# Altium schematic sheet SensorBoard.SchDoc
size A3; SheetNumber: 5; SheetTotal: 5
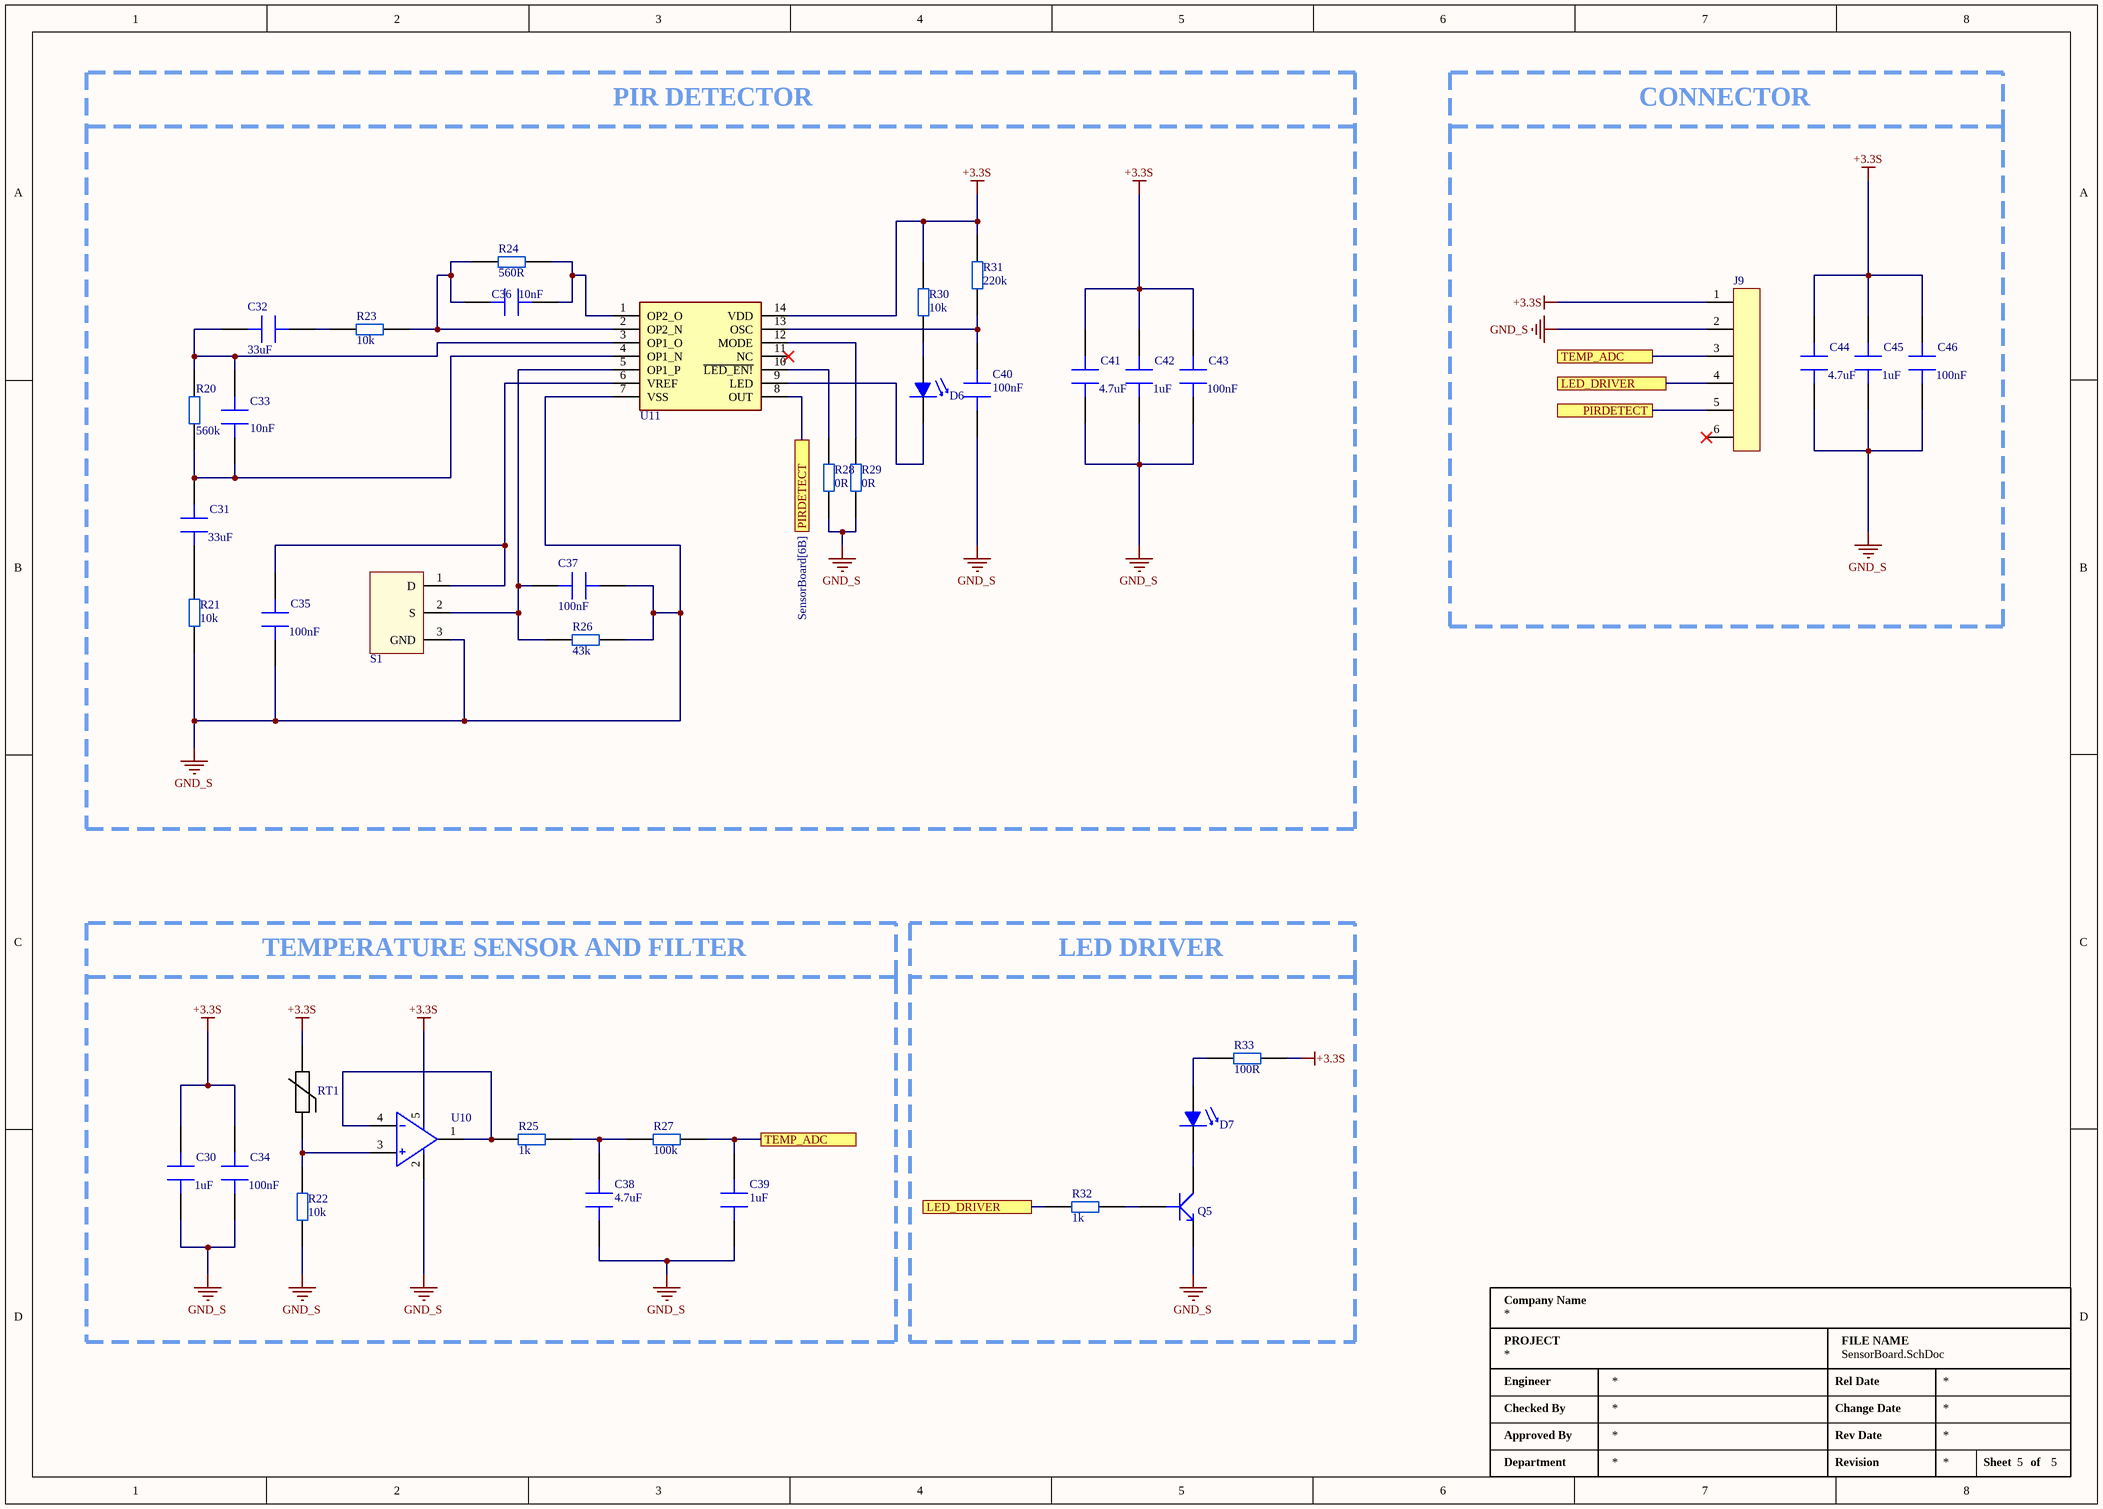
[diagram p0: SensorBoard.SchDoc]

## Parts
C30  value 1uF  [CAP 0805]  (hidden comment: Auto Grade Capacitor,0805,X7R,10)
C31  value 33uF  [CAP 1206]  (hidden comment: CAP CER 33UF 25V X5R 1206)
C32  value 33uF  [CAP 1206]  (hidden comment: CAP CER 33UF 25V X5R 1206)
C33  value 10nF  [CAP 0603]  (hidden comment: CAP CER 10nF 0603)
C34  value 100nF  [CAP 0805]  (hidden comment: CAP CER 0.1UF 50V X7R 0805)
C35  value 100nF  [CAP 0603]  (hidden comment: CAP CER 100nF 0603)
C36  value 10nF  [CAP 0603]  (hidden comment: CAP CER 10nF 0603)
C37  value 100nF  [CAP 0603]  (hidden comment: CAP CER 100nF 0603)
C38  value 4.7uF  [CAP 0805]  (hidden comment: CAP CER 4.7UF 25V X5R 0805)
C39  value 1uF  [CAP 0805]  (hidden comment: Auto Grade Capacitor,0805,X7R,10)
C40  value 100nF  [CAP 0603]  (hidden comment: CAP CER 100nF 0603)
C41  value 4.7uF  [CAP 0805]  (hidden comment: CAP CER 4.7UF 25V X5R 0805)
C42  value 1uF  [CAP 0805]  (hidden comment: Auto Grade Capacitor,0805,X7R,10)
C43  value 100nF  [CAP 0805]  (hidden comment: CAP CER 0.1UF 50V X7R 0805)
C44  value 4.7uF  [CAP 0805]  (hidden comment: CAP CER 4.7UF 25V X5R 0805)
C45  value 1uF  [CAP 0805]  (hidden comment: Auto Grade Capacitor,0805,X7R,10)
C46  value 100nF  [CAP 0805]  (hidden comment: CAP CER 0.1UF 50V X7R 0805)
D6  LED GREEN CLEAR 0805 SMD  [LED 0805]  (value not drawn)
D7  LED RED CLEAR 0805 SMD  [LED 0805]  (value not drawn)
J9  CONN HEADER VERT 6POS 1.5MM  [TUNIK 6P 2.5mm]  (value not drawn)
Q5  TRANS NPN 40V 0.2A SOT23  [SOT-23-3]  (value not drawn)
R20  value 560k  [RES 0603]  (hidden comment: RES 560K OHM 5% 1/10W 0603)
R21  value 10k  [RES 0603]  (hidden comment: RES 10K 0603)
R22  value 10k  [RES 0603]  (hidden comment: RES 10K 0603)
R23  value 10k  [RES 0603]  (hidden comment: RES 10K 0603)
R24  value 560R  [RES 0603]  (hidden comment: RES 560 OHM 1% 1/10W 0603)
R25  value 1k  [RES 0603]  (hidden comment: RES 10K 0603)
R26  value 43k  [RES 0603]  (hidden comment: RES 43K OHM 1% 1/10W 0603)
R27  value 100k  [RES 0603]  (hidden comment: RES 10K 0603)
R28  value 0R  [RES 0603]  (hidden comment: RC0603JR-070RL)
R29  value 0R  [RES 0603]  (hidden comment: RC0603JR-070RL)
R30  value 10k  [RES 0603]  (hidden comment: RES 10K 0603)
R31  value 220k  [RES 0603]  (hidden comment: RES 220K OHM 1% 1/10W 0603)
R32  value 1k  [RES 0603]  (hidden comment: RES 10K 0603)
R33  value 100R  [RES 0603]  (hidden comment: RES 10K 0603)
RT1  SENSOR PTC 10KOHM 1% 1206  [RES1206]  (value not drawn)
S1  LHI 878/3902  [LHI 878]  (value not drawn)
U10  IC OPAMP GP 1 CIRCUIT SOT23-5  [SOT-23-5]  (value not drawn)
U11  IC PIR DETECTOR CTLR 14SOIC  [SOIC14]  (value not drawn)

## Blocks framed on the sheet
PIR DETECTOR: C31-C33 C35-C37 C40-C43 D6 R20 R21 R23 R24 R26 R28-R31 S1 U11
CONNECTOR: C44-C46 J9
TEMPERATURE SENSOR AND FILTER: C30 C34 C38 C39 R22 R25 R27 RT1 U10
LED DRIVER: D7 Q5 R32 R33

## Ports
LED_DRIVER (see Microcontroller[7B], Power Management[6C], SensorBoard[4D]), LED_DRIVER (see Microcontroller[7B], Power Management[6C], SensorBoard[6B]), PIRDETECT (see SensorBoard[4B]), PIRDETECT (see SensorBoard[6B]), TEMP_ADC (see Microcontroller[7A], Power Management[6C], SensorBoard[3D]), TEMP_ADC (see Microcontroller[7A], Power Management[6C], SensorBoard[6A])

## Nets
+3.3S: C30.2 C34.2 C41.2 C42.2 C43.2 C44.2 C45.2 C46.2 J9.1 R30.2 R31.2 R33.2 RT1.2 U10.5(V+) U11.14(VDD)
GND_S: C30.1 C34.1 C35.1 C37.1 C38.1 C39.1 C40.2 C41.1 C42.1 C43.1 C44.1 C45.1 C46.1 J9.2 Q5.2(E) R21.1 R22.1 R26.1 R28.1 R29.1 S1.3(GND) U11.7(VSS)
LED_DRIVER: J9.4 R32.1 ; port LED_DRIVER
PIRDETECT: J9.5 U11.8(OUT) ; port PIRDETECT
TEMP_ADC: C39.2 J9.3 R27.1 ; port TEMP_ADC
NetC31_1: C31.1 R21.2
NetC31_2: C31.2 C33.1 R20.1 U11.4(OP1_N)
NetC32_1: C32.1 C33.2 R20.2 U11.3(OP1_O)
NetC32_2: C32.2 R23.1
NetC35_2: C35.2 S1.1(D) U11.6(VREF)
NetC36_1: C36.1 R23.2 R24.1 U11.2(OP2_N)
NetC36_2: C36.2 R24.2 U11.1(OP2_O)
NetC37_2: C37.2 R26.2 S1.2(S) U11.5(OP1_P)
NetC38_2: C38.2 R25.1 R27.2
NetC40_1: C40.1 R31.1 U11.13(OSC)
NetD6_A: D6.A R30.1
NetD6_C: D6.C U11.9(LED)
NetD7_A: D7.A R33.1
NetD7_C: D7.C Q5.3(C)
NetQ5_1: Q5.1(B) R32.2
NetR22_2: R22.2 RT1.1 U10.3(+IN)
NetR25_2: R25.2 U10.1(OUT) U10.4(-IN)
NetR28_2: R28.2 U11.10(~{LED_EN!})
NetR29_2: R29.2 U11.12(MODE)

Not connected (* = marked no-connect by the designer): J9 6*; U10 2(V-); U11 11(NC)*

## Notes on the sheet
- Company Name
- Engineer
- PROJECT
- Rel Date
- FILE NAME
- Checked By
- Approved By
- Rev Date
- Change Date
- Department
- Revision
- Sheet
- of

## Library data of the parts
C30 C39 C42 C45 = CAP MLCC 1uF 0805 MLCC: Multilayer Ceramic Capacitor, 1 uF, 25 V, ï¿½ 10%, X7R, 0805 [2012 Metric]; Manufacturer: KEMET; Manufacturer Part Number: C0805C105K3RACTU; Material: 4241ConductorMaterial; Voltage Rating: 25V; Supplier: Digikey; Supplier Part Number: 399-C0805C105K3RAC7800CT-ND; RoHS: Yes; Category: Ceramic Capacitors; Stock: 115775; Pricing: 1=0,13, 10=0,091, 50=0,054, 100=0,0425, 500=0,03142, 1000=0,02601 (USD); Mounting Technology: Surface Mount; Case/Package: 0805; Pins: 2; Case Code (Imperial): 0805; Case Code (Metric): 2012; Dielectric Material: Ceramic; Min Operating Temperature: -55°C; Max Operating Temperature: 125°C; Tolerance: 10%; Packaging: Tape and Reel; Termination: SMD/SMT; Series: C; Dielectric: X7R; Package Quantity: 2500; Voltage Rating (DC): 25V; Construction: Flat; Voltage: 25V; Length: 2mm; Width: 0.049inch; Height: 1.25mm; Depth: 1.25mm; Thickness: 0.055inch; Radiation Hardening: No; RoHS Compliant: Yes; Reach SVHC Compliant: No
C31 C32 = CAP MLCC 33uF 1206: Multilayer Ceramic Capacitor, 33 uF, 25 V, ± 20%, X5R, 1206 [3216 Metric]; Manufacturer: TDK; Manufacturer Part Number: C3216X5R1E336M160AC; Material: 4241ConductorMaterial; Designed By: SEFA; Supplier: Digikey; Supplier Part Number: 445-8046-1-ND; RoHS: Yes; Category: Ceramic Capacitors; Stock: 201261; Pricing: 1=0,98, 10=0,734, 50=0,6696, 100=0,5485, 500=0,43776, 1000=0,38625 (USD); ComponentLink1URL: https://datasheet.ciiva.com/24216/c3216x5r1e336m160ac-265051-24216512.pdf?src-supplier=Mouser; ComponentLink1Description: https://datasheet.ciiva.com/24216/c3216x5r1e336m160ac-265051-24216512.pdf?src-supplier=Mouser; ComponentLink2URL: https://datasheet.ciiva.com/6285/tdkmlcccaprange-6285278.pdf?src-supplier=Digikey; ComponentLink2Description: https://datasheet.ciiva.com/6285/tdkmlcccaprange-6285278.pdf?src-supplier=Digikey
C33 C36 = CAP MLCC 10nF 0603: Multilayer Ceramic Capacitor, 0.01 uF, 50 V, ± 10%, X7R, 0603 [1608 Metric]; Manufacturer: Yageo; Manufacturer Part Number: CC0603KRX7R9BB103; Voltage Rating: 50V; Insulation Resistance: 100GR; Designed By: SEFA; Supplier: Digikey; Supplier Part Number: 311-1085-1-ND; RoHS: Yes; Category: Ceramic Capacitors; Stock: 4173563; Pricing: 1=0,1, 10=0,031, 50=0,0176, 100=0,0136, 500=0,01026, 1000=0,00805 (USD); Mounting Technology: Surface Mount; Case/Package: 0603; Pins: 2; Case Code (Metric): 1608; Case Code (Imperial): 0603; Material: Ceramic; Min Operating Temperature: -55°C; Max Operating Temperature: 125°C; Tolerance: 10%; Packaging: Tape and Reel; Voltage Rating (DC): 50V; Package Quantity: 1; Dielectric: X7R; Termination: SMD/SMT; Voltage: 50V; Series: CC; Length: 1.6mm; Width: 0.031inch; Height: 0.8mm; Thickness: 0.035inch; Depth: 0.8mm; Radiation Hardening: No; RoHS Compliant: Yes; Reach SVHC Compliant: Unknown; Lead Free: 5697LeadFree; Halogen Free: 5694HalogenFree
C34 C43 C46 = CAP MLCC 100nF 0805: Multilayer Ceramic Capacitor, 0.1 uF, 50 V, ± 10%, X7R, 0805 [2012 Metric]; Manufacturer: Yageo; Manufacturer Part Number: CC0805KRX7R9BB104; Insulation Resistance: 100GR; Desined By: SEFA; Supplier: Digikey; Supplier Part Number: 311-1140-1-ND; RoHS: Yes; Category: Ceramic Capacitors; Stock: 4906465; Pricing: 1=0,1, 10=0,07, 50=0,0418, 100=0,0329, 500=0,02428, 1000=0,0201, 4000=0,01711, 8000=0,01592, 12000=0,01512, 28000=0,01433, 100000=0,01085, 200000=0,01059, 400000=0,00995 (USD); Mounting Technology: Surface Mount; Case/Package: 0805; Pins: 2; Case Code (Metric): 2012; Case Code (Imperial): 0805; Material: Ceramic; Min Operating Temperature: -55°C; Max Operating Temperature: 125°C; Tolerance: 10%; Dielectric: X7R; Voltage: 50V; Packaging: Tape and Reel; Voltage Rating: 50V; Package Quantity: 4000; Termination: SMD/SMT; Series: CC; Length: 2mm; Height: 0.85mm; Depth: 1.25mm; Radiation Hardening: No; RoHS Compliant: Yes; Reach SVHC Compliant: No; Lead Free: 5697LeadFree; Halogen Free: 5694HalogenFree; ComponentLink1URL: https://datasheet.ciiva.com/11786/0900766b80d84f1d-11786009.pdf?src-supplier=Rs; ComponentLink1Description: https://datasheet.ciiva.com/11786/0900766b80d84f1d-11786009.pdf?src-supplier=Rs; ComponentLink2URL: https://datasheet.ciiva.com/46393/1734573-46393307.pdf?src-supplier=Element14; ComponentLink2Description: https://datasheet.ciiva.com/46393/1734573-46393307.pdf?src-supplier=Element14; ComponentLink3URL: https://datasheet.ciiva.com/155/mlccorderingcode-155930.pdf?src-supplier=Digikey; ComponentLink3Description: https://datasheet.ciiva.com/155/mlccorderingcode-155930.pdf?src-supplier=Digikey; ComponentLink4URL: https://datasheet.ciiva.com/28450/1489800-28450805.pdf?src-supplier=Element14; ComponentLink4Description: https://datasheet.ciiva.com/28450/1489800-28450805.pdf?src-supplier=Element14; ComponentLink5URL: https://datasheet.ciiva.com/155/mlccorderingcode-155929.pdf?src-supplier=Digikey; ComponentLink5Description: https://datasheet.ciiva.com/155/mlccorderingcode-155929.pdf?src-supplier=Digikey; ComponentLink6URL: https://datasheet.ciiva.com/155/mlccorderingcode-155931.pdf?src-supplier=Digikey; ComponentLink6Description: https://datasheet.ciiva.com/155/mlccorderingcode-155931.pdf?src-supplier=Digikey; ComponentLink7URL: https://datasheet.ciiva.com/11464/upy-gphc-x7r-6-3v-to-50v-8-11464757.pdf?src-supplier=Avnet; ComponentLink7Description: https://datasheet.ciiva.com/11464/upy-gphc-x7r-6-3v-to-50v-8-11464757.pdf?src-supplier=Avnet; ComponentLink8URL: https://datasheet.ciiva.com/29242/445210-da-01-en-kerko-chip-0805-x7r-0-1uf-10proz-50vg-29242074.pdf?src-supplier=Conrad; ComponentLink8Description: https://datasheet.ciiva.com/29242/445210-da-01-en-kerko-chip-0805-x7r-0-1uf-10proz-50vg-29242074.pdf?src-supplier=Conrad
C35 C37 C40 = CAP MLCC 100nF 0603: Multilayer Ceramic Capacitor, 0.1 uF, 50 V, ± 10%, X7R, 0603 [1608 Metric]; Manufacturer: Kyocera AVX; Manufacturer Part Number: 06035C104K4T2A; Material: 4241ConductorMaterial; Voltage Rating: 50V; Dissipation Factor: 2.5%; Designed By: SEFA; Supplier: Mouser; Supplier Part Number: 581-06035C104K4; RoHS: Yes; Category: Ceramic Capacitors; Stock: 306954; Pricing: 1=0,1, 10=0,043, 50=0,043, 100=0,021, 1000=0,013, 10000=0,01 (USD); Mounting Technology: Surface Mount; Case/Package: 0603; Pins: 2; Case Code (Metric): 1608; Case Code (Imperial): 0603; Dielectric Material: 4241ConductorMaterial; Min Operating Temperature: -55°C; Max Operating Temperature: 125°C; Package Quantity: 1; Tolerance: 10%; Packaging: Tape and Reel; Voltage Rating (DC): 50V; Dielectric: X7R; Termination: SMD/SMT; Voltage: 50V; Series: -; Construction: Flat; Length: 1.6mm; Width: 0.032inch; Height: 0.9mm; Thickness: 0.035inch; Depth: 0.81mm; Ratings: AEC-Q200; Radiation Hardening: No; Lead Free: 5697LeadFree; Reach SVHC Compliant: No; RoHS Compliant: Yes; ComponentLink1URL: https://datasheet.ciiva.com/26859/getdatasheetpartid-379206-26859871.pdf?src-supplier=Verical; ComponentLink1Description: https://datasheet.ciiva.com/26859/getdatasheetpartid-379206-26859871.pdf?src-supplier=Verical; ComponentLink2URL: https://datasheet.ciiva.com/11786/0900766b80dc2409-11786365.pdf?src-supplier=Rs; ComponentLink2Description: https://datasheet.ciiva.com/11786/0900766b80dc2409-11786365.pdf?src-supplier=Rs; ComponentLink3URL: https://datasheet.ciiva.com/11503/cauto-11503989.pdf?src-supplier=Avnet; ComponentLink3Description: https://datasheet.ciiva.com/11503/cauto-11503989.pdf?src-supplier=Avnet; ComponentLink4URL: https://datasheet.ciiva.com/1457/1679506-1457867.pdf?src-supplier=Element14; ComponentLink4Description: https://datasheet.ciiva.com/1457/1679506-1457867.pdf?src-supplier=Element14; ComponentLink5URL: https://datasheet.ciiva.com/1124/1679506-1124898.pdf?src-supplier=Element14; ComponentLink5Description: https://datasheet.ciiva.com/1124/1679506-1124898.pdf?src-supplier=Element14; ComponentLink6URL: https://datasheet.ciiva.com/28613/1679506-28613279.pdf?src-supplier=Element14; ComponentLink6Description: https://datasheet.ciiva.com/28613/1679506-28613279.pdf?src-supplier=Element14; ComponentLink7URL: https://datasheet.ciiva.com/152/cauto-152703.pdf?src-supplier=Digikey; ComponentLink7Description: https://datasheet.ciiva.com/152/cauto-152703.pdf?src-supplier=Digikey; ComponentLink8URL: https://datasheet.ciiva.com/152/cauto-152702.pdf?src-supplier=Digikey; ComponentLink8Description: https://datasheet.ciiva.com/152/cauto-152702.pdf?src-supplier=Digikey; ComponentLink9URL: https://datasheet.ciiva.com/152/cauto-152704.pdf?src-supplier=Digikey; ComponentLink9Description: https://datasheet.ciiva.com/152/cauto-152704.pdf?src-supplier=Digikey; ComponentLink10URL: https://datasheet.ciiva.com/5427/cauto-360-5427029.pdf?src-supplier=Mouser; ComponentLink10Description: https://datasheet.ciiva.com/5427/cauto-360-5427029.pdf?src-supplier=Mouser
C38 C41 C44 = CAP MLCC 4.7uF 0805 MLCC: Multilayer Ceramic Capacitor, 4.7 uF, 25 V, ± 10%, X5R, 0805 [2012 Metric]; Manufacturer: Samsung; Manufacturer Part Number: CL21A475KAQNNNE; Designed By: SEFA; Supplier: Digikey; Supplier Part Number: 1276-1244-2-ND; RoHS: Yes; Category: Ceramic Capacitors; Stock: 3176000; Pricing: 2000=0,01305, 4000=0,01194, 10000=0,0111, 14000=0,01055, 50000=0,00978 (USD); Mounting Technology: Surface Mount; Case/Package: 0805; Case Code (Metric): 2012; Case Code (Imperial): 0805; Material: Ceramic; Min Operating Temperature: -55°C; Max Operating Temperature: 85°C; Packaging: Tape and Reel; Tolerance: 10%; Voltage Rating: 25V; Dielectric: X5R; Voltage Rating (DC): 25V; Series: CL; Construction: Flat; Length: 2mm; Height: 1.25mm; Depth: 1.25mm; Radiation Hardening: No; Lead Free: Lead Free; RoHS Compliant: Yes; ComponentLink1URL: https://datasheet.ciiva.com/25798/cl21a475kaqnnne-25798882.pdf?src-supplier=Digikey; ComponentLink1Description: https://datasheet.ciiva.com/25798/cl21a475kaqnnne-25798882.pdf?src-supplier=Digikey
D6 = LED GREEN 0805: WURTH ELEKTRONIK - 150080GS75000 - LED, Green, SMD, 0805, 30 mA, 3.2 V, 520 nm; Manufacturer: Wurth Electronics; Lens Color: Colorless; Viewing Angle: 140°; Lens Style: Clear,Flat,Rectangular; Luminous Intensity: 450mcd; Forward Voltage: 3.2V; Wavelength: 520nm; Forward Current: 30mA; Test Current: 20mA; Max Reverse Voltage (DC): 5V; Power Dissipation: 105mW; Lens Size: 1.25mm; Designed By: SEFA; Supplier: Digikey; Supplier Part Number: 732-4983-1-ND; Manufacturer Part Number: 150080GS75000; RoHS: Yes; Category: LEDs; Stock: 59501; Pricing: 1=0,18, 50=0,176, 100=0,151, 500=0,131 (USD); Mounting Technology: Surface Mount; Case/Package: 0805; Color: Green; Case Code (Metric): 2012; Case Code (Imperial): 0805; Min Operating Temperature: -40°C; Max Operating Temperature: 85°C; Package Quantity: 1; Packaging: Cut Tape; Dominant Wavelength: 520nm; Series: WL-SMCW; Lens Transparency: Clear; Reverse Voltage: 5V; Length: 2mm; Width: 1.25mm; Height: 0.8mm; RoHS Compliant: Yes; Reach SVHC Compliant: Unknown; ComponentLink1URL: https://datasheet.ciiva.com/29563/150080gs75000-29563008.pdf?src-supplier=Digikey; ComponentLink1Description: https://datasheet.ciiva.com/29563/150080gs75000-29563008.pdf?src-supplier=Digikey; ComponentLink2URL: https://datasheet.ciiva.com/29279/759434-da-01-en-chipled-0805-w-kl-gruen-150080gs75000-29279039.pdf?src-supplier=Conrad; ComponentLink2Description: https://datasheet.ciiva.com/29279/759434-da-01-en-chipled-0805-w-kl-gruen-150080gs75000-29279039.pdf?src-supplier=Conrad
D7 = LED RED 0805: LED Uni-Color Red 630nm 2-Pin Chip 0805(2012Metric) T/R; Manufacturer: Wurth Electronics; Manufacturer Part Number: 150080RS75000; Lens Color: Colorless; Luminous Intensity: 150mcd; Viewing Angle: 140°; Forward Voltage: 2V; Wavelength: 625nm; Lens Style: Clear,Flat,Rectangular; Forward Current: 30mA; Test Current: 20mA; Max Reverse Voltage (DC): 5V; Power Dissipation: 72mW; Lens Size: 1.25mm; Designed By: SEFA; Supplier: Digikey; Supplier Part Number: 732-4984-6-ND; RoHS: Yes; Category: LEDs; Stock: 58430; Pricing: 1=0,18, 50=0,176, 100=0,151, 500=0,131 (USD); Mounting Technology: Surface Mount; Case/Package: 0805; Color: Red; Case Code (Metric): 2012; Case Code (Imperial): 0805; Min Operating Temperature: -40°C; Max Operating Temperature: 85°C; Package Quantity: 1; Packaging: Cut Tape; Dominant Wavelength: 625nm; Series: WL-SMCW; Lens Transparency: Clear; Length: 2mm; Width: 1.25mm; Height: 0.8mm; RoHS Compliant: Yes; Reach SVHC Compliant: Unknown; ComponentLink1URL: https://datasheet.ciiva.com/22656/150080rs75000-22656961.pdf?src-supplier=Element14; ComponentLink1Description: https://datasheet.ciiva.com/22656/150080rs75000-22656961.pdf?src-supplier=Element14; ComponentLink2URL: https://datasheet.ciiva.com/29279/759435-da-01-en-chipled-0805-w-kl-rot-150080rs75000-29279032.pdf?src-supplier=Conrad; ComponentLink2Description: https://datasheet.ciiva.com/29279/759435-da-01-en-chipled-0805-w-kl-rot-150080rs75000-29279032.pdf?src-supplier=Conrad
J9 = TUNIK 6P 2.5mm: Header B6B-ZR, 1.50mm, 6-contacts, top entry, THT, /2000/box; Manufacturer: JST; Gender: 29Gender; Number of Contacts: 6NUMBER; Designed By: SEFA; Supplier: Digikey; Supplier Part Number: 455-B6B-ZR-ND; Manufacturer Part Number: B6B-ZR; RoHS: Yes; Category: Board to Board Connectors; Stock: 104604; Pricing: 1=0,3, 10=0,256, 100=0,1994, 2000=0,13512, 6000=0,1221, 10000=0,11396 (USD); Housing Color: 50Colour; Orientation: 5495OrientationType; Lead Free: 5698LeadFree; ComponentLink1URL: https://datasheet.ciiva.com/6905/zhconnector-6905949.pdf?src-supplier=Digikey; ComponentLink1Description: https://datasheet.ciiva.com/6905/zhconnector-6905949.pdf?src-supplier=Digikey
Q5 = MMBT3904 NPN TR: Transistor: NPN; bipolar; 40V; 0.2A; 350mW; -55+150 deg.C; SMD; SOT23; Manufacturer: Diotec; Designed By: SEFA; Supplier: Mouser; Supplier Part Number: 637-MMBT3904; Manufacturer Part Number: MMBT3904; RoHS: Yes; Category: BJTs; Stock: 65126; Pricing: 1=0,1, 10=0,057, 50=0,057, 100=0,047, 1000=0,033, 10000=0,016 (USD); ComponentLink1URL: http://datasheet.octopart.com/MMBT3904-Diotec-datasheet-20771870.pdf?src-supplier=Verical; ComponentLink1Description: http://datasheet.octopart.com/MMBT3904-Diotec-datasheet-20771870.pdf?src-supplier=Verical; ComponentLink2URL: http://datasheet.octopart.com/MMBT3904-Diotec-datasheet-20771870.pdf?src-supplier=Mouser; ComponentLink2Description: http://datasheet.octopart.com/MMBT3904-Diotec-datasheet-20771870.pdf?src-supplier=Mouser; ComponentLink3URL: http://datasheet.octopart.com/MMBT3904-Diotec-datasheet-20771870.pdf?src-supplier=Onlinecomponents.com; ComponentLink3Description: http://datasheet.octopart.com/MMBT3904-Diotec-datasheet-20771870.pdf?src-supplier=Onlinecomponents.com; ComponentLink4URL: http://datasheet.octopart.com/MMBT3904-Diotec-datasheet-20771870.pdf?src-supplier=Distrelec; ComponentLink4Description: http://datasheet.octopart.com/MMBT3904-Diotec-datasheet-20771870.pdf?src-supplier=Distrelec; ComponentLink5URL: http://datasheet.octopart.com/MMBT3904-Diotec-datasheet-20771870.pdf?src-supplier=DComponents; ComponentLink5Description: http://datasheet.octopart.com/MMBT3904-Diotec-datasheet-20771870.pdf?src-supplier=DComponents; ComponentLink6URL: https://datasheet.octopart.com/MMBT3904-Diotec-datasheet-137255044.pdf?src-supplier=TME; ComponentLink6Description: https://datasheet.octopart.com/MMBT3904-Diotec-datasheet-137255044.pdf?src-supplier=TME; ComponentLink7URL: http://datasheet.octopart.com/MMBT3904-Diotec-datasheet-20771870.pdf?src-supplier=Rutronik; ComponentLink7Description: http://datasheet.octopart.com/MMBT3904-Diotec-datasheet-20771870.pdf?src-supplier=Rutronik; ComponentLink8URL: http://datasheet.octopart.com/MMBT3904-Diotec-datasheet-20771870.pdf?src-supplier=Electro+Sonic; ComponentLink8Description: http://datasheet.octopart.com/MMBT3904-Diotec-datasheet-20771870.pdf?src-supplier=Electro+Sonic; ComponentLink9URL: https://datasheet.octopart.com/MMBT3904-Diotec-datasheet-168810005.pdf?src-supplier=SOS+electronic; ComponentLink9Description: https://datasheet.octopart.com/MMBT3904-Diotec-datasheet-168810005.pdf?src-supplier=SOS+electronic
R20 = RES 560k OHM 0603: SMD Chip Resistor, 560 kOhm, ± 5%, 100 mW, 0603 [1608 Metric], Thick Film, General Purpose; Manufacturer: Yageo; Manufacturer Part Number: RC0603JR-07560KL; Power Rating: 100mW; Voltage Rating: 75V; Voltage Rating (DC): 50V; Temperature Coefficient: 100ppm/°C; Designed By: SEFA; Supplier: Digikey; Supplier Part Number: 311-560KGRCT-ND; RoHS: Yes; Category: Chip SMD Resistors; Stock: 404528; Pricing: 1=0,1, 10=0,015, 50=0,0092, 100=0,0076, 500=0,00512, 1000=0,00437 (USD); Case/Package: 0603; Pins: 2; Case Code (Metric): 1608; Case Code (Imperial): 0603; Weight: 7.1E-05oz; Min Operating Temperature: -55°C; Max Operating Temperature: 155°C; Package Quantity: 1; Tolerance: 5%; Packaging: Tape and Reel; Resistor Type: Thick Film; Number of Terminations: 2; Termination: SMD/SMT; Max Power Dissipation: 100mW; Working Voltage: 75V; Features: Moisture Resistant; Series: RC; Resistance Tolerance: 5%; Technology: THICK FILM; Voltage Rating (AC): 50V; Length: 0.063inch; Width: 0.8mm; Height: 0.022inch; RoHS Compliant: Yes; Reach SVHC Compliant: Unknown; Lead Free: 5697LeadFree; ComponentLink1URL: https://datasheet.ciiva.com/2453/pyu-r-int-thick-7-2453056.pdf?src-supplier=Digikey; ComponentLink1Description: https://datasheet.ciiva.com/2453/pyu-r-int-thick-7-2453056.pdf?src-supplier=Digikey; ComponentLink2URL: https://datasheet.ciiva.com/2453/pyu-r-int-thick-7-2453057.pdf?src-supplier=Digikey; ComponentLink2Description: https://datasheet.ciiva.com/2453/pyu-r-int-thick-7-2453057.pdf?src-supplier=Digikey; ComponentLink3URL: https://datasheet.ciiva.com/2453/pyu-r-int-thick-7-2453055.pdf?src-supplier=Digikey; ComponentLink3Description: https://datasheet.ciiva.com/2453/pyu-r-int-thick-7-2453055.pdf?src-supplier=Digikey
R21-R23 R25 R27 R30 R32 R33 = RES 10K OHM 0603: Res Thick Film 0603 10K Ohm 5% 1/10W ±100ppm/°C Molded SMD SMD Paper T/R; Manufacturer: Stackpole Electronics; Manufacturer Part Number: RMCF0603JT10K0; Designed By: SEFA; Supplier: Digikey; Supplier Part Number: RMCF0603JT10K0CT-ND; RoHS: Yes; Category: Chip SMD Resistors; Stock: 14247729; Pricing: 1=0,1, 10=0,021, 50=0,0116, 100=0,0093, 500=0,00594, 1000=0,005 (USD); ComponentLink1URL: https://datasheet.ciiva.com/15193/getdatasheetpartid-364254-15193501.pdf?src-supplier=Verical; ComponentLink1Description: https://datasheet.ciiva.com/15193/getdatasheetpartid-364254-15193501.pdf?src-supplier=Verical
R24 = RES 560R OHM 0603: SMD Chip Resistor, 560 Ohm, ± 1%, 100 mW, 0603 [1608 Metric], Thick Film, General Purpose; Manufacturer: Yageo; Manufacturer Part Number: RC0603FR-07560RL; Voltage Rating (DC): 50V; Temperature Coefficient: 100ppm/°C; Power Rating: 100mW; Voltage Rating: 75V; Designed By: SEFA; Supplier: Digikey; Supplier Part Number: 311-560HRCT-ND; RoHS: Yes; Category: Chip SMD Resistors; Stock: 273492; Pricing: 1=0,1, 10=0,019, 50=0,0112, 100=0,0093, 500=0,00622, 1000=0,00532 (USD); Case/Package: 0603; Pins: 2; Case Code (Imperial): 0603; Case Code (Metric): 1608; Weight: 7.1E-05oz; Min Operating Temperature: -55°C; Max Operating Temperature: 155°C; Packaging: Tape and Reel; Tolerance: 1%; Resistor Type: Thick Film; Package Quantity: 1; Termination: SMD/SMT; Number of Terminations: 2; Max Power Dissipation: 100mW; Features: Moisture Resistant; Series: RC; Construction: Rectangular; Resistance Tolerance: 1%; Technology: THICK FILM; Voltage Rating (AC): 50V; Length: 1.6mm; Width: 0.8mm; Height: 0.45mm; Depth: 0.8mm; Reach SVHC Compliant: No; Lead Free: Lead Free; Military Standard: Not; RoHS Compliant: Yes; ComponentLink1URL: https://datasheet.ciiva.com/11808/0900766b80f96399-11808127.pdf?src-supplier=Rs; ComponentLink1Description: https://datasheet.ciiva.com/11808/0900766b80f96399-11808127.pdf?src-supplier=Rs; ComponentLink2URL: https://datasheet.ciiva.com/46412/443971-46412853.pdf?src-supplier=Element14; ComponentLink2Description: https://datasheet.ciiva.com/46412/443971-46412853.pdf?src-supplier=Element14; ComponentLink3URL: https://datasheet.ciiva.com/2454/pyu-r-int-thick-7-2454382.pdf?src-supplier=Digikey; ComponentLink3Description: https://datasheet.ciiva.com/2454/pyu-r-int-thick-7-2454382.pdf?src-supplier=Digikey; ComponentLink4URL: https://datasheet.ciiva.com/2454/pyu-r-int-thick-7-2454383.pdf?src-supplier=Digikey; ComponentLink4Description: https://datasheet.ciiva.com/2454/pyu-r-int-thick-7-2454383.pdf?src-supplier=Digikey; ComponentLink5URL: https://datasheet.ciiva.com/2454/pyu-r-int-thick-7-2454381.pdf?src-supplier=Digikey; ComponentLink5Description: https://datasheet.ciiva.com/2454/pyu-r-int-thick-7-2454381.pdf?src-supplier=Digikey; ComponentLink6URL: https://datasheet.ciiva.com/7746/443971-7746374.pdf?src-supplier=Element14; ComponentLink6Description: https://datasheet.ciiva.com/7746/443971-7746374.pdf?src-supplier=Element14; ComponentLink7URL: https://datasheet.ciiva.com/7746/443971-7746375.pdf?src-supplier=Element14; ComponentLink7Description: https://datasheet.ciiva.com/7746/443971-7746375.pdf?src-supplier=Element14
R26 = RES 43k OHM 0603: SMD Chip Resistor, 43 kOhm, ± 1%, 100 mW, 0603 [1608 Metric], Thick Film, General Purpose; Manufacturer: Yageo; Manufacturer Part Number: RC0603FR-0743KL; Voltage Rating (DC): 50V; Designed By: SEFA; Supplier: Digikey; Supplier Part Number: 311-43.0KHRCT-ND; RoHS: Yes; Category: Chip SMD Resistors; Stock: 159898; Pricing: 1=0,1, 10=0,02, 50=0,012, 100=0,0099, 500=0,00662, 1000=0,00565 (USD); Lead Free: 5697LeadFree; ComponentLink1URL: https://datasheet.ciiva.com/2454/pyu-r-int-thick-7-2454879.pdf?src-supplier=Digikey; ComponentLink1Description: https://datasheet.ciiva.com/2454/pyu-r-int-thick-7-2454879.pdf?src-supplier=Digikey; ComponentLink2URL: https://datasheet.ciiva.com/2454/pyu-r-int-thick-7-2454880.pdf?src-supplier=Digikey; ComponentLink2Description: https://datasheet.ciiva.com/2454/pyu-r-int-thick-7-2454880.pdf?src-supplier=Digikey; ComponentLink3URL: https://datasheet.ciiva.com/2454/pyu-r-int-thick-7-2454881.pdf?src-supplier=Digikey; ComponentLink3Description: https://datasheet.ciiva.com/2454/pyu-r-int-thick-7-2454881.pdf?src-supplier=Digikey; ComponentLink4URL: https://datasheet.ciiva.com/12558/rc0603-272842-12558507.pdf?src-supplier=Mouser; ComponentLink4Description: https://datasheet.ciiva.com/12558/rc0603-272842-12558507.pdf?src-supplier=Mouser
R28 R29 = RES 0R OHM 0603: GENERAL PURPOSE CHIP RESISTOR Metal Glaze/thick Film, 0.1W, 0ohm, Surface Mount, 0603; Manufacturer: Yageo; Tolerance: 1%; Power Rating: 100mW; Voltage Rating (DC): 50V; Temperature Coefficient: 200ppm/°C; Resistance Tolerance: 5%; Designed By: SEFA; Supplier: Digikey; Supplier Part Number: 311-0.0GRCT-ND; Manufacturer Part Number: RC0603JR-070RL; RoHS: Yes; Category: Chip SMD Resistors; Stock: 3503891; Pricing: 1=0,1, 10=0,015, 25=0,0112, 50=0,0086, 100=0,006, 250=0,0048, 500=0,00386, 1000=0,00284 (USD); Case/Package: 0603; Pins: 2; Contact Plating: Tin,Matte; Case Code (Imperial): 0603; Case Code (Metric): 1608; Min Operating Temperature: -55°C; Max Operating Temperature: 155°C; Resistor Type: Thick Film; Packaging: Tape and Reel; Termination: SMD/SMT; Series: RC; Technology: THICK FILM; Package Quantity: 5000; Voltage Rating: 50V; Features: Moisture Resistant; Max Power Dissipation: 100mW; Number of Terminations: 2; Construction: Rectangular; Length: 1.6mm; Width: 0.8mm; Height: 0.45mm; Depth: 0.8mm; RoHS Compliant: Yes; Reach SVHC Compliant: Unknown; Lead Free: 5697LeadFree; Military Standard: Not; ComponentLink1URL: https://datasheet.ciiva.com/11808/pyu-r-int-6-11808700.pdf?src-supplier=Rs; ComponentLink1Description: https://datasheet.ciiva.com/11808/pyu-r-int-6-11808700.pdf?src-supplier=Rs; ComponentLink2URL: https://datasheet.ciiva.com/22747/443971-22747530.pdf?src-supplier=Element14; ComponentLink2Description: https://datasheet.ciiva.com/22747/443971-22747530.pdf?src-supplier=Element14; ComponentLink3URL: https://datasheet.ciiva.com/12555/rc0603-272842-12555254.pdf?src-supplier=Mouser; ComponentLink3Description: https://datasheet.ciiva.com/12555/rc0603-272842-12555254.pdf?src-supplier=Mouser; ComponentLink4URL: https://datasheet.ciiva.com/7746/1738695-7746421.pdf?src-supplier=Element14; ComponentLink4Description: https://datasheet.ciiva.com/7746/1738695-7746421.pdf?src-supplier=Element14; ComponentLink5URL: https://datasheet.ciiva.com/7746/1738695-7746422.pdf?src-supplier=Element14; ComponentLink5Description: https://datasheet.ciiva.com/7746/1738695-7746422.pdf?src-supplier=Element14; ComponentLink6URL: https://datasheet.ciiva.com/8883/pyu-rc0603-51-rohs-l-4-8883045.pdf?src-supplier=Avnet; ComponentLink6Description: https://datasheet.ciiva.com/8883/pyu-rc0603-51-rohs-l-4-8883045.pdf?src-supplier=Avnet; ComponentLink7URL: https://datasheet.ciiva.com/15189/getdatasheetpartid-329462-15189845.pdf?src-supplier=Verical; ComponentLink7Description: https://datasheet.ciiva.com/15189/getdatasheetpartid-329462-15189845.pdf?src-supplier=Verical
R31 = RES 220k OHM 0603: Res Thick Film 0603 220K Ohm 1% 0.1W(1/10W) ±100ppm/C Pad SMD Automotive T/R; Manufacturer: Stackpole Electronics; Manufacturer Part Number: RMCF0603FT220K; Voltage Rating: 75V; Designed By: SEFA; Supplier: Digikey; Supplier Part Number: RMCF0603FT220KCT-ND; RoHS: Yes; Category: Chip SMD Resistors; Stock: 1753466; Pricing: 1=0,1, 10=0,011, 50=0,0064, 100=0,0053, 500=0,0035, 1000=0,00299 (USD); Lead Free: 5697LeadFree; ComponentLink1URL: https://datasheet.ciiva.com/26835/getdatasheetpartid-479010-26835622.pdf?src-supplier=Verical; ComponentLink1Description: https://datasheet.ciiva.com/26835/getdatasheetpartid-479010-26835622.pdf?src-supplier=Verical
RT1 = TFPT1206L1002FM: Thermistor PTC 10K Ohm 1% 2-Pin 1206 Surface Mount Solder Pad T/R Automotive; Manufacturer: Vishay Dale; Power Rating: 125mW; Voltage: 40V; Value: 10kR; Supplier: Mouser; Supplier Part Number: 71-TFPT1206L1002FM; Manufacturer Part Number: TFPT1206L1002FM; RoHS: Yes; Category: Linear ICs; Stock: 36227; Pricing: 1=1,3, 10=0,794, 50=0,794, 100=0,704, 1000=0,501, 10000=0,442 (USD); Mounting Technology: Surface Mount; Case/Package: 1206; Case Code (Imperial): 1206; Min Operating Temperature: -55°C; Max Operating Temperature: 125°C; Packaging: Tape and Reel; Package Quantity: 5000; Tolerance: 1%; Max Power Dissipation: 125mW; Termination: SMD/SMT; Series: TFPT; Resistance Tolerance: 1%; Length: 3.2mm; Width: 1.6mm; Height: 0.55mm; Lead Free: Lead Free; RoHS Compliant: Yes; ComponentLink1URL: https://datasheet.ciiva.com/2852/tfpt-2852076.pdf?src-supplier=Digikey; ComponentLink1Description: https://datasheet.ciiva.com/2852/tfpt-2852076.pdf?src-supplier=Digikey
S1 = LHI 878/3902: SENSOR PYRO DETECTOR DUAL MOTION; Manufacturer: Excelitas; Manufacturer Part Number: LHI878; Designed: SEFA; Supplier: Newark; Supplier Part Number: 27H0758; RoHS: No; Stock: 1; Pricing: 1=6,04, 10=5,23, 25=4,57, 50=4,29, 100=3,73, 250=3,11, 500=3,02 (USD); ComponentLink1URL: https://datasheet.ciiva.com/1300/dts-lhi778-lhi878-pyd1388-1300033.pdf?src-supplier=Newark; ComponentLink1Description: https://datasheet.ciiva.com/1300/dts-lhi778-lhi878-pyd1388-1300033.pdf?src-supplier=Newark; ComponentLink2URL: https://datasheet.ciiva.com/1314/923446-1314627.pdf?src-supplier=Element14; ComponentLink2Description: https://datasheet.ciiva.com/1314/923446-1314627.pdf?src-supplier=Element14
U10 = OPA314AIDBVR GPA: IC OPAMP GP 3MHZ RRO SOT23-5; Manufacturer: Texas Instruments; Designed By: SEFA; Supplier: Digikey; Supplier Part Number: 296-36699-1-ND; Manufacturer Part Number: OPA314AIDBVR; RoHS: Yes; Category: Amplifiers - Op Amps, Buffer, Instrumentation; Stock: 19748; Pricing: 1=1,16, 10=1,034, 25=0,9812, 100=0,8061, 250=0,75352, 500=0,6659, 1000=0,5257 (USD); ComponentLink1URL: https://datasheet.ciiva.com/14456/opa2314-14456281.pdf?src-supplier=Avnet; ComponentLink1Description: https://datasheet.ciiva.com/14456/opa2314-14456281.pdf?src-supplier=Avnet; ComponentLink2URL: https://datasheet.ciiva.com/14462/opa2314-14462006.pdf?src-supplier=Avnet; ComponentLink2Description: https://datasheet.ciiva.com/14462/opa2314-14462006.pdf?src-supplier=Avnet; ComponentLink3URL: https://datasheet.ciiva.com/29638/opa314-29638827.pdf?src-supplier=Digikey; ComponentLink3Description: https://datasheet.ciiva.com/29638/opa314-29638827.pdf?src-supplier=Digikey
U11 = NCS36000DRG: NCS36000 Series Single 5.75V Passive Infrared Detector Controller (PIR) -SOIC-14; Manufacturer: ON Semiconductor; Operating Supply Current: 50uA; Quiescent Current: 20uA; Min Supply Voltage: 3V; Output Type: Digital; Designed By: SEFA; Supplier: Arrow Electronics; Supplier Part Number: NCS36000DRG; Manufacturer Part Number: NCS36000DRG; RoHS: Yes; Category: Amplifiers - Op Amps, Buffer, Instrumentation; Stock: 10; Pricing: 1=0,8891, 3000=0,4538, 6000=0,4318, 15000=0,427 (USD); Case/Package: SOIC; Pins: 14; Min Operating Temperature: -40°C; Max Operating Temperature: 85°C; Package Quantity: 3000; Packaging: Tape and Reel; Max Supply Voltage: 5.75V; Series: -; Input Type: DIGITAL; Nominal Supply Current: 20uA; Length: 8.75mm; Width: 4mm; Height: 1.5mm; Radiation Hardening: No; Reach SVHC Compliant: No; Lead Free: Lead Free; Halogen Free: Halogen Free; RoHS Compliant: Yes; ComponentLink1URL: https://datasheet.ciiva.com/4763/ncs36000-d-89569-4763639.pdf?src-supplier=Mouser; ComponentLink1Description: https://datasheet.ciiva.com/4763/ncs36000-d-89569-4763639.pdf?src-supplier=Mouser; ComponentLink2URL: https://datasheet.ciiva.com/2966/ncs36000-d-2966525.pdf?src-supplier=Avnet; ComponentLink2Description: https://datasheet.ciiva.com/2966/ncs36000-d-2966525.pdf?src-supplier=Avnet